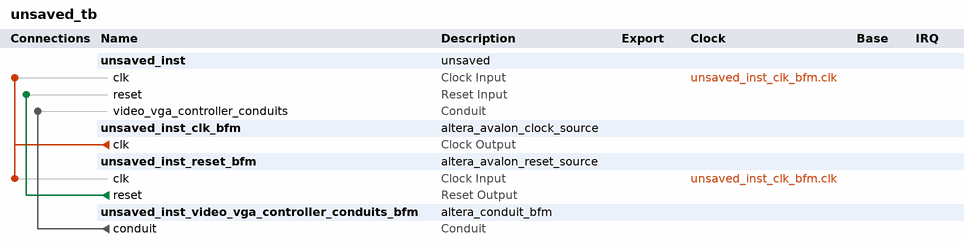
[diagram p0: system contents]
# Platform Designer (Qsys) system unsaved_tb, Cyclone IV E EP4CE115F29C7
# Parameters at their usual value, and those the tool derives, are not listed.
package require -exact qsys 20.1
create_system unsaved_tb
set_project_property DEVICE_FAMILY {Cyclone IV E}
set_project_property DEVICE EP4CE115F29C7

add_instance unsaved_inst unsaved 1.0

add_instance unsaved_inst_clk_bfm altera_avalon_clock_source 20.1

add_instance unsaved_inst_reset_bfm altera_avalon_reset_source 20.1
set_instance_parameter_value unsaved_inst_reset_bfm ASSERT_HIGH_RESET 0
set_instance_parameter_value unsaved_inst_reset_bfm INITIAL_RESET_CYCLES 50

add_instance unsaved_inst_video_vga_controller_conduits_bfm altera_conduit_bfm 20.1
set_instance_parameter_value unsaved_inst_video_vga_controller_conduits_bfm CLOCKED_SIGNAL false
set_instance_parameter_value unsaved_inst_video_vga_controller_conduits_bfm ENABLE_RESET false
set_instance_parameter_value unsaved_inst_video_vga_controller_conduits_bfm SIGNAL_DIRECTIONS input,input,input,input,input,input,input,input
set_instance_parameter_value unsaved_inst_video_vga_controller_conduits_bfm SIGNAL_ROLES B,BLANK,CLK,G,HS,R,SYNC,VS
set_instance_parameter_value unsaved_inst_video_vga_controller_conduits_bfm SIGNAL_WIDTHS 8,1,1,8,1,8,1,1

# connections
add_connection unsaved_inst_clk_bfm.clk unsaved_inst.clk clock
add_connection unsaved_inst_clk_bfm.clk unsaved_inst_reset_bfm.clk clock
add_connection unsaved_inst_reset_bfm.reset unsaved_inst.reset reset
add_connection unsaved_inst_video_vga_controller_conduits_bfm.conduit unsaved_inst.video_vga_controller_conduits conduit

set_interconnect_requirement {$system} qsys_mm.clockCrossingAdapter HANDSHAKE
set_interconnect_requirement {$system} qsys_mm.enableEccProtection FALSE
set_interconnect_requirement {$system} qsys_mm.insertDefaultSlave FALSE
set_interconnect_requirement {$system} qsys_mm.maxAdditionalLatency 1

save_system unsaved_tb.qsys
